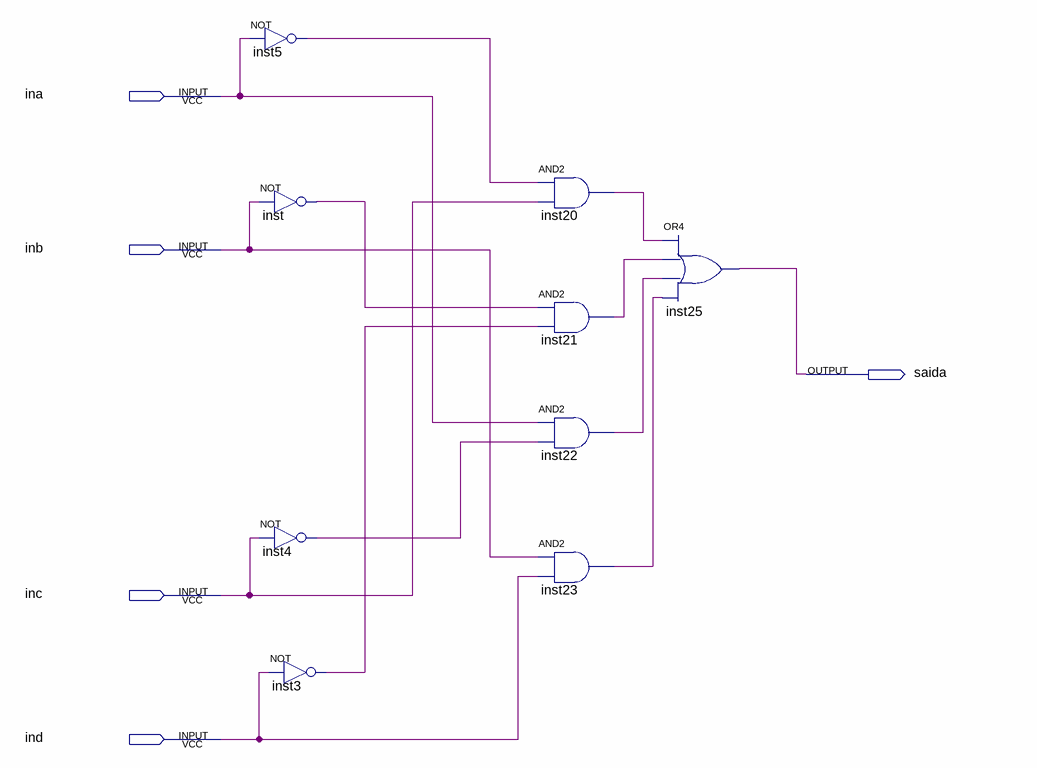
[diagram p0: schematic sheet]
// Quartus schematic a.bdf as structural Verilog: 9 symbols, 5 pins
module a (
  input  ina,
  input  inb,
  input  inc,
  input  ind,
  output saida
);

  wire inst3_out, inst4_out, inst5_out, inst20_out, inst21_out, inst22_out, inst23_out, inst_out;

  not inst5 (inst5_out, ina);
  not inst (inst_out, inb);
  not inst4 (inst4_out, inc);
  not inst3 (inst3_out, ind);
  and inst20 (inst20_out, inst5_out, inc);
  and inst21 (inst21_out, inst_out, inst3_out);
  and inst22 (inst22_out, ina, inst4_out);
  and inst23 (inst23_out, inb, ind);
  or inst25 (saida, inst20_out, inst21_out, inst22_out, inst23_out);
endmodule
